# EAGLE design pixelAdapter_f103c8 pro (EAGLE 9.5.2)
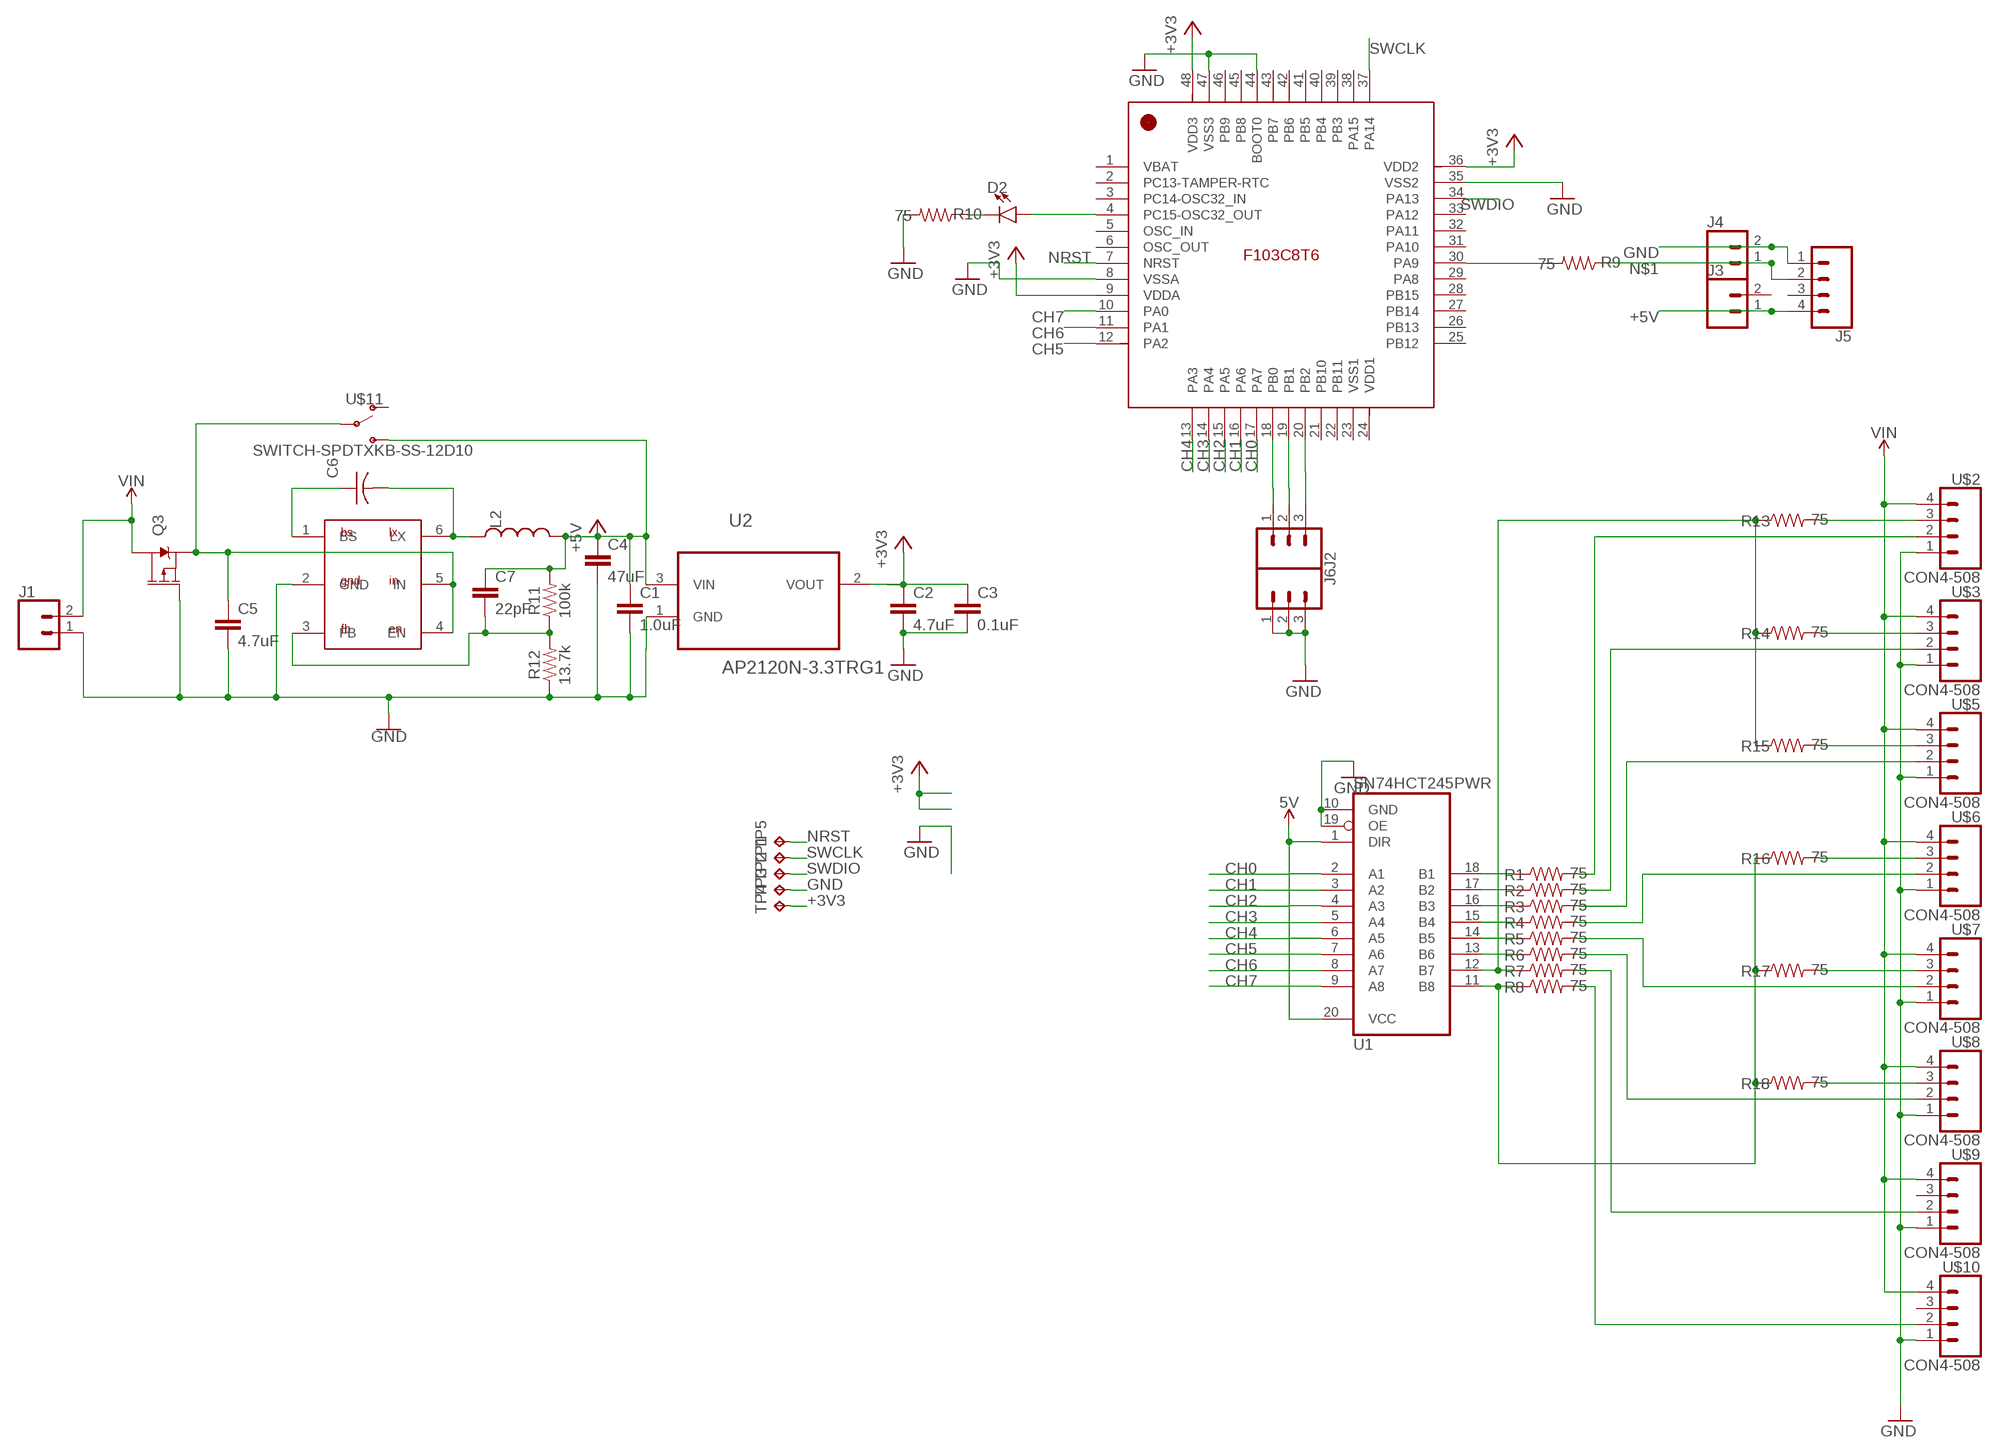
[diagram p0: schematic, sheet 1]

## Parts
C1  1.0uF  1.0UF-0603-16V-10%  [0603]
C2  4.7uF  4.7UF0603  [0603]
C3  0.1uF  0.1UF-0603-25V-(+80/-20%)  [0603]
C4  47uF  4.7UF-1206-16V-(+80/-20%)  [1206]
C5  4.7uF  4.7UF-1206-16V-(+80/-20%)  [1206]
C6  0.1uF  C-USC0402K  [C0402K]
C7  22pF  22PF-0603-50V-5%  [0603]
D2  LED0603  [LED-0603]
J1  CONN_025MM  [SCREWTERMINAL-5MM-2]
J2  CONN_03LOCK  [1X03_LOCK]
J3  CONN_025MM  [SCREWTERMINAL-5MM-2]
J4  CONN_025MM  [SCREWTERMINAL-5MM-2]
J5  CONN_04LOCK  [1X04_LOCK]
J6  CONN_03LOCK  [1X03_LOCK]
L2  INDUCTOR3030  [INDUCTOR-3030]
Q3  2.5A/30V/105mΩ  MOSFET_PCH-DMG2307L  [SOT23-3]
R1  75  100OHM-0603-1/4W-5%  [0603]
R2  75  100OHM-0603-1/4W-5%  [0603]
R3  75  100OHM-0603-1/4W-5%  [0603]
R4  75  100OHM-0603-1/4W-5%  [0603]
R5  75  100OHM-0603-1/4W-5%  [0603]
R6  75  100OHM-0603-1/4W-5%  [0603]
R7  75  100OHM-0603-1/4W-5%  [0603]
R8  75  100OHM-0603-1/4W-5%  [0603]
R9  75  100OHM-0603-1/4W-5%  [0603]
R10  75  100OHM-0603-1/4W-5%  [0603]
R11  100k  100KOHM-0603-1/10W-1%  [0603]
R12  13.7k  13.7KOHM-0603-1/10W-1%  [0603]
R13  75  100OHM-0603-1/4W-5%  [0603]
R14  75  100OHM-0603-1/4W-5%  [0603]
R15  75  100OHM-0603-1/4W-5%  [0603]
R16  75  100OHM-0603-1/4W-5%  [0603]
R17  75  100OHM-0603-1/4W-5%  [0603]
R18  75  100OHM-0603-1/4W-5%  [0603]
TP1  TPTP20SQ  [TP20SQ]
TP2  TPTP20SQ  [TP20SQ]
TP3  TPTP20SQ  [TP20SQ]
TP4  TPTP20SQ  [TP20SQ]
TP5  TPTP20SQ  [TP20SQ]
U1  SN74HCT245PWR  74245PW  [TSSOP20]
U2  AP2120N-3.3TRG1  MCP1700T-3302E/TT  [SOT95P237X112-3N]
U$1  STM32F103C8T6  [LQFP48_7X7MM_0.5MMPP]
U$2  CON4-508  [CON4-508]
U$3  CON4-508  [CON4-508]
U$4  SY8120B1ABC  [SOT23-6]
U$5  CON4-508  [CON4-508]
U$6  CON4-508  [CON4-508]
U$7  CON4-508  [CON4-508]
U$8  CON4-508  [CON4-508]
U$9  CON4-508  [CON4-508]
U$10  CON4-508  [CON4-508]
U$11  SWITCH-SPDTXKB-SS-12D10  [SWITCH-XKB-SS-12D10]

## Nets
+3V3: C2.1 C3.1 TP4.TP U2.2(VOUT) U$1.9(VDDA) U$1.36(VDD2) U$1.48(VDD3)
+5V: C1.1 C4.1 C7.1 J3.1 J5.4 L2.P$2 R11.2 U1.1(DIR) U1.20(VCC) U2.3(VIN) U$11.P$3(S) ; supply symbol labelled 5V
ADDR0: J2.1 U$1.18(PB0)
ADDR1: J2.2 U$1.19(PB1)
ADDR2: J2.3 U$1.20(PB2)
CH0: U1.2(A1) U$1.17(PA7)
CH1: U1.3(A2) U$1.16(PA6)
CH2: U1.4(A3) U$1.15(PA5)
CH3: U1.5(A4) U$1.14(PA4)
CH4: U1.6(A5) U$1.13(PA3)
CH5: U1.7(A6) U$1.12(PA2)
CH6: U1.8(A7) U$1.11(PA1)
CH7: U1.9(A8) U$1.10(PA0)
GND: C1.2 C2.2 C3.2 C4.2 C5.2 J1.1 J4.2 J5.1 J6.1 J6.2 J6.3 Q3.1(G) R10.2 R12.1 TP3.TP U1.10(GND) U1.19(OE) U2.1(GND) U$1.8(VSSA) U$1.35(VSS2) U$1.44(BOOT0) U$1.47(VSS3) U$2.1 U$3.1 U$4.2(GND) U$5.1 U$6.1 U$7.1 U$8.1 U$9.1 U$10.1
LED0: R1.2 U$2.2
LED1: R2.2 U$3.2
LED2: R3.2 U$5.2
LED3: R4.2 U$6.2
LED4: R5.2 U$7.2
LED5: R6.2 U$8.2
LED6: R7.2 U$9.2
LED7: R8.2 U$10.2
LEDS0: R1.1 U1.18(B1)
LEDS1: R2.1 U1.17(B2)
LEDS2: R3.1 U1.16(B3)
LEDS3: R4.1 U1.15(B4)
LEDS4: R5.1 U1.14(B5)
LEDS5: R6.1 U1.13(B6)
LEDS6: R7.1 R13.1 R14.1 R15.1 U1.12(B7)
LEDS7: R8.1 R16.1 R17.1 R18.1 U1.11(B8)
N$1: J4.1 J5.2 R9.1
N$3: D2.A U$1.4(PC15-OSC32_OUT)
N$6: R13.2 U$2.3
N$7: R14.2 U$3.3
N$8: C6.1 U$4.1(BS)
N$9: C6.2 L2.P$1 U$4.6(LX)
N$10: C7.2 R11.1 R12.2 U$4.3(FB)
N$11: R15.2 U$5.3
N$20: R16.2 U$6.3
N$21: D2.C R10.1
N$22: R17.2 U$7.3
N$23: R18.2 U$8.3
NRST: TP5.TP U$1.7(NRST)
RX: R9.2 U$1.30(PA9)
SWCLK: TP1.TP U$1.37(PA14)
SWDIO: TP2.TP U$1.34(PA13)
VIN: J1.2 Q3.3(D) U$2.4 U$3.4 U$5.4 U$6.4 U$7.4 U$8.4 U$9.4 U$10.4
VIN1: C5.1 Q3.2(S) U$4.4(EN) U$4.5(IN) U$11.P$2(P)
Unconnected: J3.2 J5.3 U$1.1(VBAT) U$1.2(PC13-TAMPER-RTC) U$1.3(PC14-OSC32_IN) U$1.5(OSC_IN) U$1.6(OSC_OUT) U$1.21(PB10) U$1.22(PB11) U$1.23(VSS1) U$1.24(VDD1) U$1.25(PB12) U$1.26(PB13) U$1.27(PB14) U$1.28(PB15) U$1.29(PA8) U$1.31(PA10) U$1.32(PA11) U$1.33(PA12) U$1.38(PA15) U$1.39(PB3) U$1.40(PB4) U$1.41(PB5) U$1.42(PB6) U$1.43(PB7) U$1.45(PB8) U$1.46(PB9) U$9.3 U$10.3 U$11.P$1(O)

## Library data of the parts
C1 = SparkFun-Capacitors:1.0UF: 1µF ceramic capacitors A capacitor is a passive two-terminal electrical component used to store electrical energy temporarily in an electric field.; PROD_ID: CAP-00868
C2 = SparkFun-Capacitors:4.7UF: 4.7µF ceramic capacitors A capacitor is a passive two-terminal electrical component used to store electrical energy temporarily in an electric field.; PROD_ID: CAP-08280
C3 = SparkFun-Capacitors:0.1UF: 0.1µF ceramic capacitors A capacitor is a passive two-terminal electrical component used to store electrical energy temporarily in an electric field.; PROD_ID: CAP-00810
C4 = SparkFun-Capacitors:4.7UF: 4.7µF ceramic capacitors A capacitor is a passive two-terminal electrical component used to store electrical energy temporarily in an electric field.; PROD_ID: CAP-10300; VALUE: 4.7uF
C5 = SparkFun-Capacitors:4.7UF: 4.7µF ceramic capacitors A capacitor is a passive two-terminal electrical component used to store electrical energy temporarily in an electric field.; PROD_ID: CAP-10300
C6 = adafruit:C-US: CAPACITOR, American symbol
C7 = SparkFun-Capacitors:22PF: 22pF ceramic capacitors A capacitor is a passive two-terminal electrical component used to store electrical energy temporarily in an electric field.; PROD_ID: CAP-07876
D2 = SparkFun-LED:LED: LED (Generic) Standard schematic elements and footprints for 5mm, 3mm, 1206, and 0603 sized LEDs. Generic LEDs with no color specified.
J1 J3 J4 = bens:CONN_02: Multi connection point. Often used as Generic Header-pin footprint for 0.1 inch spaced/style header connections On any of the 0.1 inch spaced packages, you can populate with these: Break Away Headers - Straight <https://www.sparkfun.com/products/116> (PRT-00116) Break Away Male Headers - Right Angle <https://www.sparkfun.com/products/553> (PRT-00553) Female Headers <https://www.sparkfun.com/products/115> (PRT-00115) Break Away Headers - Machine Pin <https://www.sparkfun.com/products/117> (PRT-00117) Break Away Female Headers - Swiss Machine Pin <https://www.sparkfun.com/products/743> (PRT-00743) For SCREWTERMINALS and SPRING TERMINALS visit here: Screw Terimnals on SparkFun.com <https://www.sparkfun.com/search/results?term=Screw+Terminals> (5mm/3.5mm/2.54mm spacing) This device is also useful as a general connection point to wire up your design to another part of your project. Our various solder wires solder well into these plated through hole pads. Hook-Up Wire - Assortment (Stranded, 22 AWG) <https://www.sparkfun.com/products/11375> (PRT-11375) Hook-Up Wire - Assortment (Solid Core, 22 AWG) <https://www.sparkfun.com/products/11367> (PRT-11367) View the entire wire category on our website here <https://www.sparkfun.com/categories/141> Special notes: Molex polarized connector foot print use with: PRT-08233 with associated crimp pins and housings. 2.54_SCREWTERM for use with PRT-10571. 3.5mm Screw Terminal footprints for PRT-08084 5mm Screw Terminal footprints for use with PRT-08432; SF_SKU: PRT-08432
J2 J6 = SparkFun-Connectors:CONN_03: Multi connection point. Often used as Generic Header-pin footprint for 0.1 inch spaced/style header connections On any of the 0.1 inch spaced packages, you can populate with these: Break Away Headers - Straight <https://www.sparkfun.com/products/116> (PRT-00116) Break Away Male Headers - Right Angle <https://www.sparkfun.com/products/553> (PRT-00553) Female Headers <https://www.sparkfun.com/products/115> (PRT-00115) Break Away Headers - Machine Pin <https://www.sparkfun.com/products/117> (PRT-00117) Break Away Female Headers - Swiss Machine Pin <https://www.sparkfun.com/products/743> (PRT-00743) Stackable Header - 3 Pin (Female, 0.1") <https://www.sparkfun.com/products/13875> (PRT-13875) For SCREWTERMINALS and SPRING TERMINALS visit here: Screw Terimnals on SparkFun.com <https://www.sparkfun.com/search/results?term=Screw+Terminals> (5mm/3.5mm/2.54mm spacing) This device is also useful as a general connection point to wire up your design to another part of your project. Our various solder wires solder well into these plated through hole pads. Hook-Up Wire - Assortment (Stranded, 22 AWG) <https://www.sparkfun.com/products/11375> (PRT-11375) Hook-Up Wire - Assortment (Solid Core, 22 AWG) <https://www.sparkfun.com/products/11367> (PRT-11367) View the entire wire category on our website here <https://www.sparkfun.com/categories/141> Special notes: Molex polarized connector foot print use with SKU : PRT-08232 with associated crimp pins and housings.
J5 = SparkFun-Connectors:CONN_04: Multi connection point. Often used as Generic Header-pin footprint for 0.1 inch spaced/style header connections On any of the 0.1 inch spaced packages, you can populate with these: Break Away Headers - Straight <https://www.sparkfun.com/products/116> (PRT-00116) Break Away Male Headers - Right Angle <https://www.sparkfun.com/products/553> (PRT-00553) Female Headers <https://www.sparkfun.com/products/115> (PRT-00115) Break Away Headers - Machine Pin <https://www.sparkfun.com/products/117> (PRT-00117) Break Away Female Headers - Swiss Machine Pin <https://www.sparkfun.com/products/743> (PRT-00743) For SCREWTERMINALS and SPRING TERMINALS visit here: Screw Terimnals on SparkFun.com <https://www.sparkfun.com/search/results?term=Screw+Terminals> (5mm/3.5mm/2.54mm spacing) This device is also useful as a general connection point to wire up your design to another part of your project. Our various solder wires solder well into these plated through hole pads. Hook-Up Wire - Assortment (Stranded, 22 AWG) <https://www.sparkfun.com/products/11375> (PRT-11375) Hook-Up Wire - Assortment (Solid Core, 22 AWG) <https://www.sparkfun.com/products/11367> (PRT-11367) View the entire wire category on our website here <https://www.sparkfun.com/categories/141> Special notes: Molex polarized connector foot print use with SKU : PRT-08231 with associated crimp pins and housings. 1MM SMD Version SKU: PRT-10208; PROD_ID: CONN-09696
L2 = bens:INDUCTOR: ABRACON ASPI-4030S-3R3M-T 4mmx4mm
Q3 = SparkFun-DiscreteSemi:MOSFET_PCH: P-channel MOSFETs Voltage controlled devices that allow control of high current outputs. SparkFun Products: SparkFun ESP32 Thing <https://www.sparkfun.com/products/13907> SparkFun ESP8266 Thing <https://www.sparkfun.com/products/13231>; PROD_ID: TRANS-11308
R1-R10 R13-R18 = SparkFun-Resistors:100OHM: 100Ω resistor A resistor is a passive two-terminal electrical component that implements electrical resistance as a circuit element. Resistors act to reduce current flow, and, at the same time, act to lower voltage levels within circuits. - Wikipedia; PROD_ID: RES-12438; VALUE: 100
R11 = SparkFun-Resistors:100KOHM: 100kΩ resistor A resistor is a passive two-terminal electrical component that implements electrical resistance as a circuit element. Resistors act to reduce current flow, and, at the same time, act to lower voltage levels within circuits. - Wikipedia; PROD_ID: RES-07828
R12 = SparkFun-Resistors:13.7KOHM: 13.7kΩ resistor A resistor is a passive two-terminal electrical component that implements electrical resistance as a circuit element. Resistors act to reduce current flow, and, at the same time, act to lower voltage levels within circuits. - Wikipedia; PROD_ID: RES-08603
TP1-TP5 = testpad:TP: Test pad
U1 = scanlime:74*245: Octal BUS TRANSCEIVER, 3-state
U2 = Microchip_By_element14_Batch_1:MCP1700T-3302E/TT: Low Quiescent Current LDO; MPN: MCP1700T-3302E/TT; OC_FARNELL: 1296592; OC_NEWARK: 88H9817; PACKAGE: SOT23-3; SUPPLIER: Microchip
U$1 = STM32F103C8T6:STM32F103C8T6; AVAILABILITY: Unavailable; DESCRIPTION: Mainstream Performance line, ARM Cortex-M3 MCU with 64 Kbytes Flash, 72 MHz CPU, motor control, USB and CAN; MF: STMicroelectronics; MP: STM32F103C8T6; PACKAGE: LQFP-48 STMicroelectronics; PRICE: None
U$2 U$3 U$5-U$10 = bens:CON4-508
U$4 = bens:SY8120B1ABC
U$11 = bens:SWITCH-SPDT

## Board
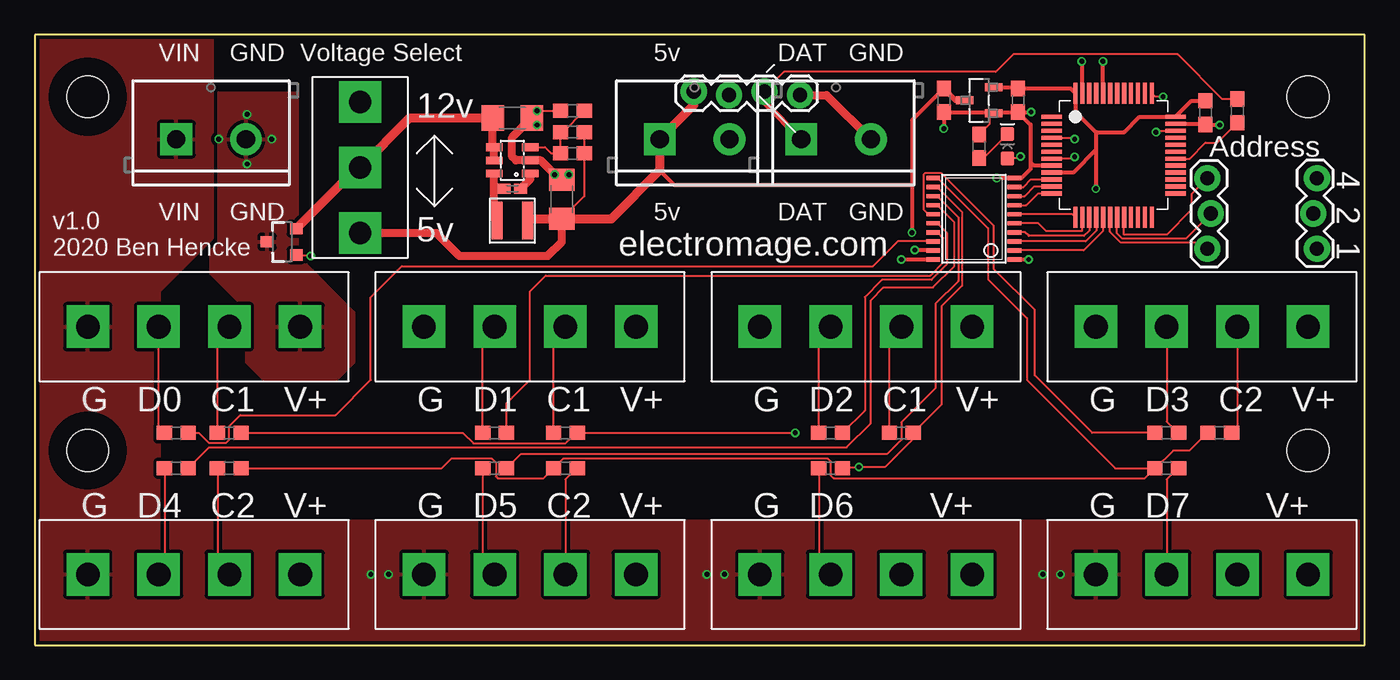
[diagram p1: board, top side]
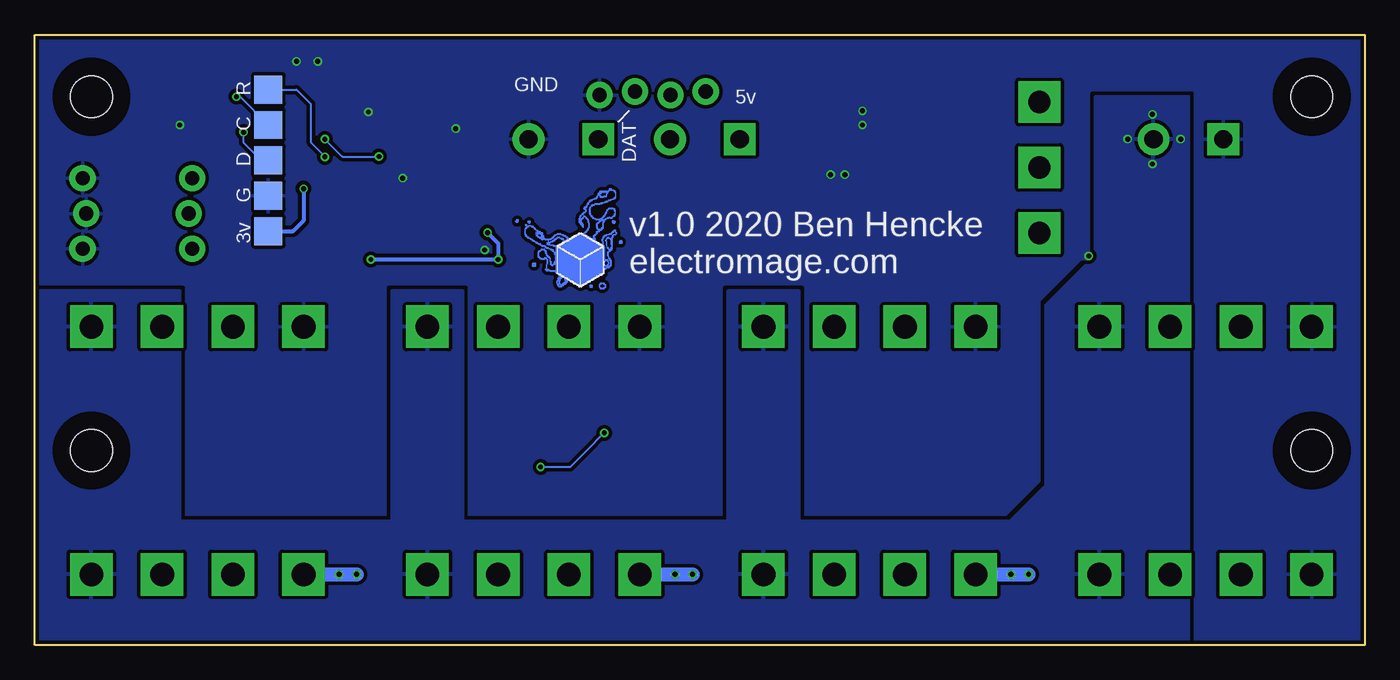
[diagram p2: board, bottom side, seen from below]

Size 95.5 x 43.81 mm. Coordinates in mm from the lower left corner, seen from the top.
Outline: 0,0 95.5,0 95.5,43.81 0,43.81 0,0
Copper layers (1*2*15*16): Top 0.035559375mm / dielectric 0.47751875mm / Route2 0.035559375mm / dielectric 0.47751875mm / Route15 0.035559375mm / dielectric 0.47751875mm / Bottom 0.035559375mm
Design rules "SparkFun-4-layer-FAB-LIMIT": minimum track width 4mil, minimum drill 6mil, track to track 5mil, track to pad 5mil, pad to pad 5mil, via to via 5mil, smd to smd 5mil, copper to edge 4mil, drill to drill 4mil, minimum pad ring 5mil, minimum via ring 5mil, stop-mask expansion 4mil, vias tented up to drill 25mil, thermal gap 10mil
Holes 3 mm at 3.81,13.97 91.44,13.97 3.81,39.37 91.44,39.37
tRestrict: area 2.5,12.7 to 5.1,15.2; area 2.5,38.1 to 5.1,40.6; area 90.2,38.1 to 92.7,40.6; area 90.2,12.7 to 92.7,15.2
bRestrict: area 2.5,12.7 to 5.1,15.2; area 2.5,38.1 to 5.1,40.6; area 90.2,38.1 to 92.7,40.6; area 90.2,12.7 to 92.7,15.2

### Footprints (pad centres in the part's own frame; a part is rotated, then mirrored left to right if it is on the bottom)
0603 = smd 1.1 x 1: 1 -0.85,0; 2 0.85,0
1206 = smd 1.6 x 1.8: 1 -1.4,0; 2 1.4,0
C0402K = smd 0.925 x 0.74: 1 -0.6,0; 2 0.6,0
LED-0603 = smd 1 x 1: A -0.877,0; C 0.877,0
SCREWTERMINAL-5MM-2 = drill 1.3 pad 2.286 square: 1 0,0 | drill 1.3 pad 2.286: 2 5,0
1X03_LOCK = drill 1.016 pad 1.88: 1 0,0.127; 2 2.54,-0.127; 3 5.08,0.127
1X04_LOCK = drill 1.016 pad 1.88: 1 0,0.127; 2 2.54,-0.127; 3 5.08,0.127; 4 7.62,-0.127
INDUCTOR-3030 = smd 0.8 x 2.7: P$1 1.1,0; P$2 -1.1,0
SOT23-3 = smd 0.8 x 0.9: 1 -0.95,-1; 2 0.95,-1; 3 0,1.1
TP20SQ = smd 2 x 2: TP 0,0
TSSOP20 = smd 0.305 x 0.991: 1 -2.925,-2.918; 2 -2.275,-2.918; 3 -1.625,-2.918; 4 -0.975,-2.918; 5 -0.325,-2.918; 6 0.325,-2.918; 7 0.975,-2.918; 8 1.625,-2.918; 9 2.275,-2.918; 10 2.925,-2.918; 11 2.925,2.918; 12 2.275,2.918; 13 1.625,2.918; 14 0.975,2.918; 15 0.325,2.918; 16 -0.325,2.918; 17 -0.975,2.918; 18 -1.625,2.918; 19 -2.275,2.918; 20 -2.925,2.918
SOT95P237X112-3N = smd 0.559 x 1.27: 1 -0.94,-1.041; 2 0.94,-1.041; 3 0,1.041
LQFP48_7X7MM_0.5MMPP = smd 1.5 x 0.3: 1 -4.45,2.75; 2 -4.45,2.25; 3 -4.45,1.75; 4 -4.45,1.25; 5 -4.45,0.75; 6 -4.45,0.25; 7 -4.45,-0.25; 8 -4.45,-0.75; 9 -4.45,-1.25; 10 -4.45,-1.75; 11 -4.45,-2.25; 12 -4.45,-2.75; 25 4.45,-2.75; 26 4.45,-2.25; 27 4.45,-1.75; 28 4.45,-1.25; 29 4.45,-0.75; 30 4.45,-0.25; 31 4.45,0.25; 32 4.45,0.75; 33 4.45,1.25; 34 4.45,1.75; 35 4.45,2.25; 36 4.45,2.75 | smd 0.3 x 1.5: 13 -2.75,-4.45; 14 -2.25,-4.45; 15 -1.75,-4.45; 16 -1.25,-4.45; 17 -0.75,-4.45; 18 -0.25,-4.45; 19 0.25,-4.45; 20 0.75,-4.45; 21 1.25,-4.45; 22 1.75,-4.45; 23 2.25,-4.45; 24 2.75,-4.45; 37 2.75,4.45; 38 2.25,4.45; 39 1.75,4.45; 40 1.25,4.45; 41 0.75,4.45; 42 0.25,4.45; 43 -0.25,4.45; 44 -0.75,4.45; 45 -1.25,4.45; 46 -1.75,4.45; 47 -2.25,4.45; 48 -2.75,4.45
CON4-508 = drill 1.7 pad 3.048 square: 1 -7.62,0; 2 -2.54,0; 3 2.54,0; 4 7.62,0
SOT23-6 = smd 0.55 x 1.2: 1 -0.95,-1.3; 2 0,-1.3; 3 0.95,-1.3; 4 0.95,1.3; 5 0,1.3; 6 -0.95,1.3
SWITCH-XKB-SS-12D10 = drill 1.6 pad 3 square: P$1 -4.7,0; P$2 0,0; P$3 4.7,0

### Placement (x,y rotation side)
C1  65.28,39.12 270 top
C2  70.61,39.12 270 top
C3  84.07,38.23 270 top
C4  37.85,32 90 top
C5  34.29,37.85 0 top
C6  34.29,32.77 180 top
C7  38.61,35.31 180 top
D2  69.85,35.81 90 top
J1  10.16,36.32 0 top
J2  84.33,28.45 90 top
J3  44.88,36.32 0 top
J4  55.04,36.32 0 top
J5  54.94,39.62 180 top
J6  91.95,33.53 270 top
L2  34.29,30.48 180 top
Q3  17.78,28.96 90 top
R1  10.16,15.24 180 top
R2  33.02,15.24 180 top
R3  57.15,15.24 180 top
R4  81.28,15.24 0 top
R5  10.16,12.7 180 top
R6  33.02,12.7 180 top
R7  57.15,12.7 180 top
R8  81.28,12.7 0 top
R9  86.36,38.35 270 top
R10  67.82,35.81 90 top
R11  38.61,36.83 0 top
R12  38.61,38.35 0 top
R13  13.97,15.24 180 top
R14  38.1,15.24 180 top
R15  62.23,15.24 180 top
R16  85.09,15.24 0 top
R17  13.97,12.7 180 top
R18  38.1,12.7 0 top
TP1  78.74,37.34 0 bottom
TP2  78.74,34.8 0 bottom
TP3  78.74,32.26 0 bottom
TP4  78.74,29.72 0 bottom
TP5  78.74,39.88 180 bottom
U1  67.44,30.61 90 top
U2  67.82,39.12 90 top
U$1  77.47,35.18 0 top
U$2  11.43,22.86 0 top
U$3  35.56,22.86 0 top
U$4  34.29,34.8 90 top
U$5  59.69,22.86 0 top
U$6  83.82,22.86 0 top
U$7  11.43,5.08 0 top
U$8  35.56,5.08 0 top
U$9  59.69,5.08 0 top
U$10  83.82,5.08 0 top
U$11  23.37,34.29 270 top
U$12  [ELECTRO_MAGE_PCB4_PIXEL_2#PNG]  57.15,29.21 0 bottom

### Tracks (layer width: path | path; a pad name or v marks a point on that pad's centre or on a via)
+3V3  (via drill 0.35)
  Top 0.305: U2.2 70.52,40.06 C2.1 74.38,39.97 U$1.48 74.72,38.31 76.2,36.83 | 76.2,36.83 78.23,36.83 79.33,37.93 U$1.36 83.07,39.08 C3.1 | 76.2,36.83 76.2,35.56 | U$1.9 74.57,33.93 76.2,35.56 | 76.2,35.56 v76.2,32.77
  Bottom 0.305: TP4.TP 76.96,29.72 76.2,30.48 v76.2,32.77
+5V  (via drill 0.35)
  Top 0.152: R11.2 C7.1 39.46,32.22 C4.1
  Top 0.305: U1.1 v71.37,27.69 | C1.1 62.99,37.68 62.99,33.02 | 62.99,33.02 v62.99,29.61 | U1.20 v62.23,27.68 v62.23,27.69 | 62.99,33.02 45.94,33.02 44.88,34.08
  Top 0.406: U2.3 66.13,39.12 C1.1
  Top 0.559: U$11.P$3 28.83,29.59 30.48,27.94 36.83,27.94 37.85,28.96 C4.1
  Top 0.635: L2.P$2 35.51,30.6 C4.1 41.4,30.6 44.88,34.08 J3.1 47.32,38.76 J5.4
  Bottom 0.305: v71.37,27.69 64.77,27.69 v62.23,27.69 62.23,28.85 v62.99,29.61
ADDR0
  Top 0.152: J2.1 83.74,28.91 78,28.91 77.22,29.69 U$1.18
ADDR1
  Top 0.152: J2.2 82.65,29.18 78.12,29.18 77.72,29.58 U$1.19
ADDR2
  Top 0.152: J2.3 83.06,32.38 83.06,31.24 81.28,29.46 78.23,29.46 78.22,29.48 U$1.20
CH0
  Top 0.152: U$1.17 76.71,30.72 76.71,29.72 75.32,28.33 U1.2
CH1
  Top 0.152: U$1.16 76.22,29.74 75.46,28.98 U1.3
CH2
  Top 0.152: U$1.15 75.72,29.75 75.35,29.38 71.37,29.38 71.12,29.63 U1.4
CH3
  Top 0.152: U$1.14 75.18,30.69 75.18,29.72 72.64,29.72 72.08,30.28 U1.5
CH4
  Top 0.152: U$1.13 74.52,30.93 U1.6
CH5
  Top 0.152: U1.7 71.21,31.58 72.05,32.43 U$1.12
CH6
  Top 0.152: U1.8 71.09,32.23 71.79,32.93 U$1.11
CH7
  Top 0.152: U1.9 70.98,32.88 71.53,33.43 U$1.10
GND  (via drill 0.35)
  Top 0.152: R10.2 68.58,37.43 68.58,38.27 | C5.2 35.69,38.35 R12.1 | Q3.1 19.75,28.01 v19.81,27.94
  Top 0.305: C2.2 71.51,37.37 71.51,34.94 | 71.51,34.94 71.51,34.17 70.86,33.53 U1.10 v69.09,33.53 | 71.51,34.94 71.51,34.68 71.76,34.43 U$1.8 | U2.1 68.95,38.27 C2.2 | U2.1 68.77,38.27 68.58,38.27 C1.2 v65.28,37.08 | 68.77,38.01 68.69,38.01 U2.1 | U$1.35 84.02,37.43 C3.2 85.05,37.38 v85.09,37.34 | U$1.47 75.22,41.87 v75.18,41.91 | U$1.44 76.71,39.64 v76.71,41.91 | U1.19 63.23,28.33 v63.2,28.37 | C2.2 71.54,38.27 v71.55,38.28
  Top 0.559: C5.2 34.29,36.45 34.29,35.05 34.54,34.8 U$4.2 36.32,34.8 37.72,33.4 C4.2 | J5.1 56.87,39.49 J4.2
  Top 0.635: C4.2 38.35,33.4 v38.35,33.78 | v36.07,38.35 36.07,38.22 C5.2
  Bottom 0.635: U$9.1 v49.53,5.08 | U$10.1 v73.66,5.08
  Bottom 1.016: U$8.1 v24.13,5.08 | U$9.1 v48.26,5.08 | U$10.1 v72.39,5.08
  other vias: 36.07,37.34 37.34,33.78 25.4,5.08
  pour Bottom (isolate 0.254, rank 6): 0,43.94 95.25,43.94 95.25,0 0,0
  pour Top (isolate 0.254): 95.25,8.89 95.25,0 0,0 0,43.69 12.7,43.69 12.7,29.21 8.89,25.4 8.89,8.89
LED0
  Top 0.152: R1.2 8.89,15.66 U$2.2
LED1
  Top 0.152: R2.2 32.17,22.01 U$3.2
LED2
  Top 0.152: R3.2 56.3,22.01 U$5.2
LED3
  Top 0.152: U$6.2 81.28,16.04 82.08,15.24 R4.2
LED4
  Top 0.152: R5.2 9.31,5.5 U$7.2
LED5
  Top 0.152: R6.2 32.17,5.93 U$8.2
LED6
  Top 0.152: R7.2 56.3,5.93 U$9.2
LED7
  Top 0.152: R8.2 82.08,12.7 81.28,11.9 U$10.2
LEDS0
  Top 0.152: U1.18 61.98,28.98 60.2,27.2 26.36,27.2 24.13,24.98 24.13,19.05 21.59,16.51 14.75,16.51 13.97,15.73 13.97,14.75 13.75,14.54 12.49,14.54 11.78,15.24 R1.1
LEDS1
  Top 0.152: U1.17 64.8,29.63 65.22,29.22 65.22,27.45 64.3,26.53 36.69,26.53 35.56,25.4 35.56,19.05 33.87,17.36 R2.1
LEDS2
  Top 0.152: U1.16 64.8,30.28 65.5,29.59 65.5,27.33 64.39,26.23 60.85,26.23 59.6,24.98 59.6,16.84 R3.1
LEDS3
  Top 0.152: U1.15 64.18,30.93 63.82,31.29 63.82,33.77 63.94,33.89 65.1,33.89 68.87,30.11 68.87,27 71.81,24.06 71.81,19.37 75.95,15.24 R4.1
LEDS4
  Top 0.152: U1.14 64.8,31.58 66.03,30.36 66.03,27.21 64.5,25.69 60.96,25.69 60.03,24.76 60.03,15.93 58.3,14.2 12.51,14.2 R5.1
LEDS5
  Top 0.152: U1.13 64.8,32.23 66.31,30.73 66.31,26.13 64.69,24.5 64.69,18.45 62.23,16 62.23,14.76 61.2,13.72 34.89,13.72 R6.1
LEDS6  (via drill 0.35)
  Top 0.152: R14.1 38.86,15.24 | 38.86,15.24 38.52,15.24 38.86,15.24 | 38.86,15.24 v54.61,15.24 | R13.1 30.73,15.24 31.5,14.48 38.1,14.48 38.86,15.24 | U1.12 64.8,32.88 66.59,31.1 66.59,25.8 65.11,24.32 65.11,17.27 R15.1 63.08,14.82 61.05,12.79 v59.18,12.79 58.09,12.79 R7.1
  Bottom 0.152: v54.61,15.24 55.88,13.97 57.06,12.79 v59.18,12.79
LEDS7
  Top 0.152: R16.1 84.19,15.24 82.92,13.97 81.75,13.97 80.48,12.7 R8.1 | U1.11 64.86,33.53 68.46,29.94 68.46,26.27 71.25,23.48 71.25,19.04 77.59,12.7 R8.1 | R17.1 29.21,12.7 29.91,13.4 32.8,13.4 33.12,13.09 33.12,12.12 33.24,12 36.55,12 R18.1 37.95,13.4 56.93,13.4 57.15,13.19 57.15,12.21 57.37,12 79.73,12 R8.1
N$1
  Top 0.152: R9.1 85.28,39.2 82.07,42.41 70.27,42.41 69,41.15 53.8,41.15 J5.2
  Top 0.406: J4.1 52.4,38.96 J5.2
N$3  (via drill 0.35)
  Top 0.152: U$1.4 74.57,36.43 v74.68,36.32 | v70.79,35.08 70.65,34.94 D2.A
  Bottom 0.152: v74.68,36.32 73.43,35.08 v70.79,35.08
N$6
  Top 0.152: R13.2 13.12,22.01 U$2.3
N$7
  Top 0.152: R14.2 37.25,22.01 U$3.3
N$8
  Top 0.559: C6.1 35.59,33.47 U$4.1
N$9
  Top 0.559: L2.P$1 32.99,30.68 32.99,32.77 | 32.99,32.77 U$4.6 | C6.2 32.99,32.77
N$10
  Top 0.152: R12.2 37.93,36.83 R11.1 C7.2 37.08,35.31 36.64,35.75 U$4.3
N$11
  Top 0.152: R15.2 61.38,22.01 U$5.3
N$20
  Top 0.152: U$6.3 86.36,15.66 R16.2
N$21
  Top 0.152: D2.C 68.12,34.96 R10.1
N$22
  Top 0.152: R17.2 13.12,5.93 U$7.3
N$23
  Top 0.152: R18.2 38.9,12.7 38.1,11.9 U$8.3
NRST  (via drill 0.35)
  Top 0.152: v74.68,35.05 74.55,34.93 U$1.7
  Bottom 0.152: TP5.TP 76.71,39.88 75.69,38.86 75.69,36.11 74.68,35.1 v74.68,35.05
RX
  Top 0.152: U$1.30 82.94,34.93 84.07,36.07 84.92,36.07 R9.2
SWCLK  (via drill 0.35)
  Top 0.152: v81.03,39.37 80.48,39.37 U$1.37
  Bottom 0.152: TP1.TP 80.77,39.37 v81.03,39.37
SWDIO  (via drill 0.35)
  Top 0.152: v80.52,36.83 80.62,36.93 U$1.34
  Bottom 0.152: TP2.TP 79.25,34.8 80.52,36.07 v80.52,36.83
VIN  (via drill 0.35)
  other vias: 15.24,38.1 15.24,34.54 17.02,36.32 13.21,36.32
  pour Top (isolate 0.254, rank 5): 12.7,39.62 18.8,39.62 18.8,27.94 22.86,23.88 22.86,20.32 21.59,19.05 16.51,19.05 15.24,20.32 15.24,24.13 12.7,26.67
  pour Bottom (isolate 0.254): 12.7,39.37 12.7,0 95.25,0 95.25,8.89 25.4,8.89 22.86,11.43 22.86,24.38 19.3,27.94 19.3,39.37
  pour Bottom (isolate 0.254): 40.64,25.4 45.72,25.4 45.72,5.08 40.64,5.08
  pour Bottom (isolate 0.254): 64.77,25.4 69.85,25.4 69.85,5.08 64.77,5.08
  pour Bottom (isolate 0.254): 85.09,25.4 95.25,25.4 95.25,5.08 85.09,5.08
VIN1
  Top 0.559: U$4.5 U$4.4 32.89,35.85 C5.1
  Top 0.635: Q3.2 23.16,34.29 U$11.P$2 26.92,37.85 C5.1

### Text on the board
tPlace: VIN | GND | Voltage Select | 5v | DAT | GND | 12v | Address | 4 | 2 | VIN | GND | 5v | DAT | GND | 5v | 1 | v1.0 / 2020 Ben Hencke | electromage.com | G D0 C1 V+ | G D1 C1 V+ | G D2 C1 V+ | G D3 C2 V+ | G D4 C2 V+ | G D5 C2 V+ | G D6 V+ | G D7 V+
bPlace: v1.0 2020 Ben Hencke / electromage.com
_bNames: R | GND | 5v | DAT | C | D | G | 3v